# EAGLE schematic Small_robot_PCB_schematic (EAGLE 7.7.0)
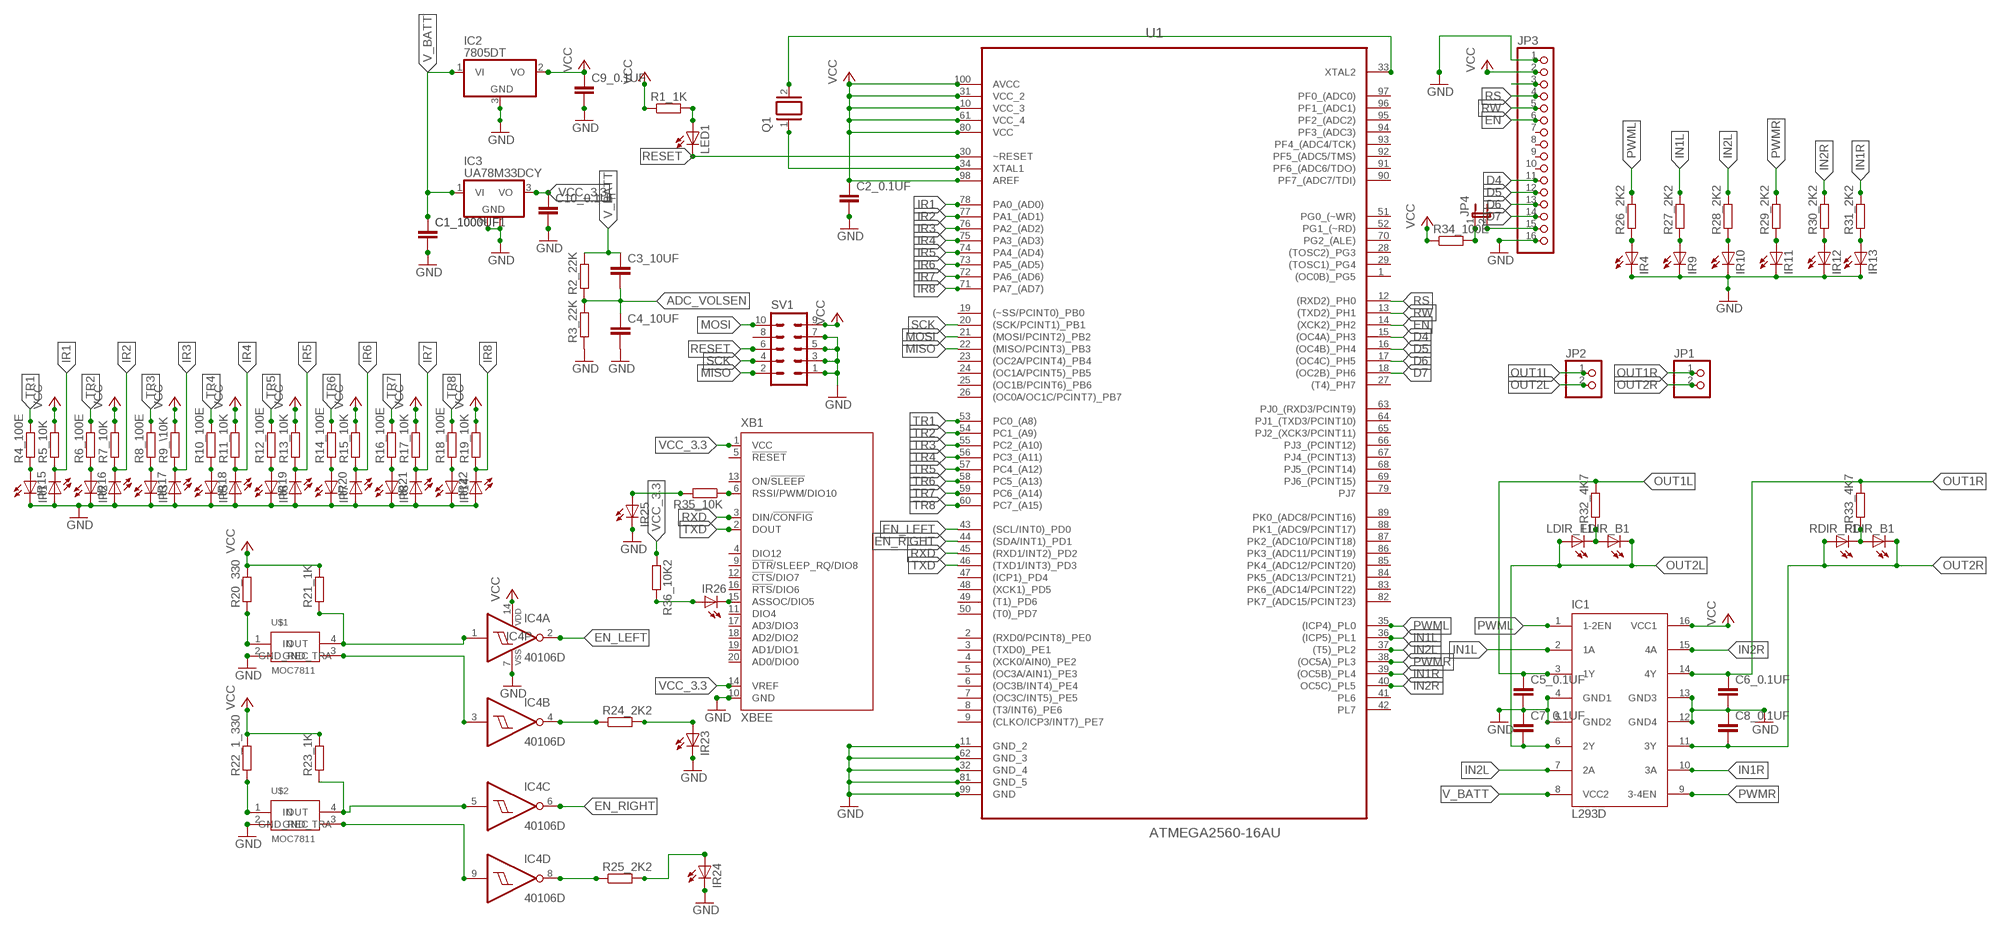
[diagram p0: schematic, sheet 1]

## Parts
C1_1000UF  C-EUC1206  [C1206]
C1_1000UF1  C-EUC1206  [C1206]
C2_0.1UF  C-EUC1206  [C1206]
C3_10UF  C-EUC1206  [C1206]
C4_10UF  C-EUC1206  [C1206]
C5_0.1UF  C-EUC1206  [C1206]
C6_0.1UF  C-EUC1206  [C1206]
C7_0.1UF  C-EUC1206  [C1206]
C8_0.1UF  C-EUC1206  [C1206]
C9_0.1UF  C-EUC1206  [C1206]
C10_0.1UF  C-EUC1206  [C1206]
IC1  L293D  [DIL16]
IC2  7805DT  [TO252]
IC3  UA78M33DCY  [SOT223]
IC4  40106D  [SO14]
IR1  LED5MM  [LED5MM]
IR2  LED5MM  [LED5MM]
IR3  LED5MM  [LED5MM]
IR4  LEDCHIPLED_1206  [CHIPLED_1206]
IR5  LED5MM  [LED5MM]
IR6  LED5MM  [LED5MM]
IR7  LED5MM  [LED5MM]
IR8  LED5MM  [LED5MM]
IR9  LEDCHIPLED_1206  [CHIPLED_1206]
IR10  LEDCHIPLED_1206  [CHIPLED_1206]
IR11  LEDCHIPLED_1206  [CHIPLED_1206]
IR12  LEDCHIPLED_1206  [CHIPLED_1206]
IR13  LEDCHIPLED_1206  [CHIPLED_1206]
IR14  LED5MM  [LED5MM]
IR15  LED5MM  [LED5MM]
IR16  LED5MM  [LED5MM]
IR17  LED5MM  [LED5MM]
IR18  LED5MM  [LED5MM]
IR19  LED5MM  [LED5MM]
IR20  LED5MM  [LED5MM]
IR21  LED5MM  [LED5MM]
IR22  LED5MM  [LED5MM]
IR23  LEDCHIPLED_1206  [CHIPLED_1206]
IR24  LEDCHIPLED_1206  [CHIPLED_1206]
IR25  LEDCHIPLED_1206  [CHIPLED_1206]
IR26  LEDCHIPLED_1206  [CHIPLED_1206]
JP1  PINHD-1X2  [1X02]
JP2  PINHD-1X2  [1X02]
JP3  PINHD-1X16  [1X16]
JP4  JP1E  [JP1]
LDIR_B1  LEDCHIPLED_1206  [CHIPLED_1206]
LDIR_F1  LEDCHIPLED_1206  [CHIPLED_1206]
LED1  LEDCHIPLED_1206  [CHIPLED_1206]
Q1  XTAL  [Q]
R1_1K  R-EU_R1206  [R1206]
R2_22K  R-EU_R1206  [R1206]
R3_22K  R-EU_M1206  [M1206]
R4_100E  R-EU_R1206  [R1206]
R5_10K  R-EU_R1206  [R1206]
R6_100E  R-EU_R1206  [R1206]
R7_10K  R-EU_R1206  [R1206]
R8_100E  R-EU_R1206  [R1206]
R9_\10K  R-EU_R1206  [R1206]
R10_100E  R-EU_R1206  [R1206]
R11_10K  R-EU_R1206  [R1206]
R12_100E  R-EU_R1206  [R1206]
R13_10K  R-EU_R1206  [R1206]
R14_100E  R-EU_R1206  [R1206]
R15_10K  R-EU_R1206  [R1206]
R16_100E  R-EU_R1206  [R1206]
R17_10K  R-EU_R1206  [R1206]
R18_100E  R-EU_R1206  [R1206]
R19_10K  R-EU_R1206  [R1206]
R20_330  R-EU_R1206  [R1206]
R21_1K  R-EU_R1206  [R1206]
R22_1_330  R-EU_R1206  [R1206]
R23_1K  R-EU_R1206  [R1206]
R24_2K2  R-EU_R1206  [R1206]
R25_2K2  R-EU_R1206  [R1206]
R26_2K2  R-EU_R1206  [R1206]
R27_2K2  R-EU_R1206  [R1206]
R28_2K2  R-EU_R1206  [R1206]
R29_2K2  R-EU_R1206  [R1206]
R30_2K2  R-EU_R1206  [R1206]
R31_2K2  R-EU_R1206  [R1206]
R32_4K7  R-EU_R1206  [R1206]
R33_4K7  R-EU_R1206  [R1206]
R34_100E  R-EU_R1206  [R1206]
R35_10K  R-EU_R1206  [R1206]
R36_10K2  R-EU_R1206  [R1206]
RDIR_B1  LEDCHIPLED_1206  [CHIPLED_1206]
RDIR_F1  LEDCHIPLED_1206  [CHIPLED_1206]
SV1  MA05-2  [MA05-2]
U1  ATMEGA2560-16AU  [QFP50P1600X1600X120-100N]
U$1  MOC7811  [THROUGH_HOLE_NORMAL]
U$2  MOC7811  [THROUGH_HOLE_NORMAL]
XB1  XBEE  [XBEE]

## Nets
ADC_VOLSEN: C3_10UF.2 C4_10UF.1 R2_22K.1 R3_22K.2
D4: JP3.11 U1.15((OC4A)_PH3)
D5: JP3.12 U1.16((OC4B)_PH4)
D6: JP3.13 U1.17((OC4C)_PH5)
D7: JP3.14 U1.18((OC2B)_PH6)
EN: JP3.6 U1.14((XCK2)_PH2)
EN_LEFT: IC4.2(A:O) U1.43((SCL/INT0)_PD0)
EN_RIGHT: IC4.6(C:O) U1.44((SDA/INT1)_PD1)
GND: C1_1000UF1.2 C1_1000UF.2 C2_0.1UF.2 C4_10UF.2 C5_0.1UF.2 C6_0.1UF.2 C7_0.1UF.1 C8_0.1UF.1 C9_0.1UF.2 C10_0.1UF.2 IC1.4(GND1) IC1.5(GND2) IC1.12(GND4) IC1.13(GND3) IC2.3(GND) IC3.2(GND) IC3.4(GND) IC4.7(P:VSS) IR1.K(C) IR2.K(C) IR3.K(C) IR4.C IR5.K(C) IR6.K(C) IR7.K(C) IR8.K(C) IR9.C IR10.C IR11.C IR12.C IR13.C IR14.K(C) IR15.A IR16.A IR17.A IR18.A IR19.A IR20.A IR21.A IR22.A IR23.C IR24.C IR25.C JP3.1 JP3.16 R3_22K.1 SV1.1 SV1.3 SV1.5 SV1.7 U1.11(GND_2) U1.32(GND_4) U1.62(GND_3) U1.81(GND_5) U1.99(GND) U$1.2(GND_TRA) U$2.2(GND_TRA) XB1.10(GND)
IN1L: IC1.2(1A) R27_2K2.2 U1.36((ICP5)_PL1)
IN1R: IC1.10(3A) R31_2K2.2 U1.39((OC5B)_PL4)
IN2L: IC1.7(2A) R28_2K2.2 U1.37((T5)_PL2)
IN2R: IC1.15(4A) R30_2K2.2 U1.40(OC5C)_PL5)
IR1: IR15.K(C) R5_10K.1 U1.78(PA0_(AD0))
IR2: IR16.K(C) R7_10K.1 U1.77(PA1_(AD1))
IR3: IR17.K(C) R9_\10K.1 U1.76(PA2_(AD2))
IR4: IR18.K(C) R11_10K.1 U1.75(PA3_(AD3))
IR5: IR19.K(C) R13_10K.1 U1.74(PA4_(AD4))
IR6: IR20.K(C) R15_10K.1 U1.73(PA5_(AD5))
IR7: IR21.K(C) R17_10K.1 U1.72(PA6_(AD6))
IR8: IR22.K(C) R19_10K.1 U1.71(PA7_(AD7))
MISO: SV1.2 U1.22((MISO/PCINT3)_PB3)
MOSI: SV1.10 U1.21((MOSI/PCINT2)_PB2)
N: JP3.3
N$1: R20_330.1 U$1.1(IN)
N$2: Q1.1 U1.34(XTAL1)
N$3: Q1.2 U1.33(XTAL2)
N$4: IR1.A R4_100E.1
N$5: IR2.A R6_100E.1
N$6: IR3.A R8_100E.1
N$7: IR5.A R10_100E.1
N$8: LED1.A R1_1K.2
N$9: IR6.A R12_100E.1
N$10: IR7.A R14_100E.1
N$11: IR8.A R16_100E.1
N$12: IR14.A R18_100E.1
N$14: IR4.A R26_2K2.1
N$15: IC4.4(B:O) R24_2K2.1
N$16: IR23.A R24_2K2.2
N$17: IC4.8(D:O) R25_2K2.1
N$18: IR24.A R25_2K2.2
N$19: R22_1_330.1 U$2.1(IN)
N$21: IR9.A R27_2K2.1
N$22: IR10.A R28_2K2.1
N$23: IC4.5(C:I) R23_1K.1 U$2.4(OUT)
N$24: IR11.A R29_2K2.1
N$25: IR12.A R30_2K2.1
N$26: IR13.A R31_2K2.1
N$27: R35_10K.1 XB1.6(RSSI/PWM/DIO10)
N$28: R33_4K7.1 RDIR_B1.A RDIR_F1.C
N$29: IC4.1(A:I) R21_1K.1 U$1.4(OUT)
N$30: IC4.3(B:I) U$1.3(GND_REC)
N$31: IC4.9(D:I) U$2.3(GND_REC)
N$32: IR25.A R35_10K.2
N$33: IR26.C XB1.15(ASSOC/DIO5)
N$34: IR26.A R36_10K2.2
N$35: LDIR_B1.A LDIR_F1.C R32_4K7.1
N$39: JP3.15 JP4.2
N$49: JP4.1 R34_100E.2
OUT1L: C5_0.1UF.1 IC1.3(1Y) JP2.1 R32_4K7.2
OUT1R: C6_0.1UF.1 IC1.14(4Y) JP1.1 R33_4K7.2
OUT2L: C7_0.1UF.2 IC1.6(2Y) JP2.2 LDIR_B1.C LDIR_F1.A
OUT2R: C8_0.1UF.2 IC1.11(3Y) JP1.2 RDIR_B1.C RDIR_F1.A
PWML: IC1.1(1-2EN) R26_2K2.2 U1.35((ICP4)_PL0)
PWMR: IC1.9(3-4EN) R29_2K2.2 U1.38((OC5A)_PL3)
RESET: LED1.C SV1.6 U1.30(~RESET)
RS: JP3.4 U1.12((RXD2)_PH0)
RW: JP3.5 U1.13((TXD2)_PH1)
RXD: U1.45((RXD1/INT2)_PD2) XB1.3(DIN/!CONFIG)
SCK: SV1.4 U1.20((SCK/PCINT1)_PB1)
TR1: R4_100E.2 U1.53(PC0_(A8))
TR2: R6_100E.2 U1.54(PC1_(A9))
TR3: R8_100E.2 U1.55(PC2_(A10))
TR4: R10_100E.2 U1.56(PC3_(A11))
TR5: R12_100E.2 U1.57(PC4_(A12))
TR6: R14_100E.2 U1.58(PC5_(A13))
TR7: R16_100E.2 U1.59(PC6_(A14))
TR8: R18_100E.2 U1.60(PC7_(A15))
TXD: U1.46((TXD1/INT3)_PD3) XB1.2(DOUT)
V_BATT: C1_1000UF1.1 C1_1000UF.1 C3_10UF.1 IC1.8(VCC2) IC2.1(VI) IC3.1(VI) R2_22K.2
VCC: C2_0.1UF.1 C9_0.1UF.1 IC1.16(VCC1) IC2.2(VO) IC4.14(P:VDD) JP3.2 R1_1K.1 R5_10K.2 R7_10K.2 R9_\10K.2 R11_10K.2 R13_10K.2 R15_10K.2 R17_10K.2 R19_10K.2 R20_330.2 R21_1K.2 R22_1_330.2 R23_1K.2 R34_100E.1 SV1.9 U1.10(VCC_3) U1.31(VCC_2) U1.61(VCC_4) U1.80(VCC) U1.98(AREF) U1.100(AVCC)
VCC_3.3: C10_0.1UF.1 IC3.3(VO) R36_10K2.1 XB1.1(VCC) XB1.14(VREF)
Unconnected: IC4.10(E:O) IC4.11(E:I) IC4.12(F:O) IC4.13(F:I) JP3.7 JP3.8 JP3.9 JP3.10 SV1.8 U1.1((OC0B)_PG5) U1.2((RXD0/PCINT8)_PE0) U1.3((TXD0)_PE1) U1.4((XCK0/AIN0)_PE2) U1.5((OC3A/AIN1)_PE3) U1.6((OC3B/INT4)_PE4) U1.7((OC3C/INT5)_PE5) U1.8((T3/INT6)_PE6) U1.9((CLKO/ICP3/INT7)_PE7) U1.19((~SS/PCINT0)_PB0) U1.23((OC2A/PCINT4)_PB4) U1.24((OC1A/PCINT5)_PB5) U1.25((OC1B/PCINT6)_PB6) U1.26((OC0A/OC1C/PCINT7)_PB7) U1.27((T4)_PH7) U1.28((TOSC2)_PG3) U1.29((TOSC1)_PG4) U1.41(PL6) U1.42(PL7) U1.47((ICP1)_PD4) U1.48((XCK1)_PD5) U1.49((T1)_PD6) U1.50((T0)_PD7) U1.51(PG0_(~WR)) U1.52(PG1_(~RD)) U1.63(PJ0_(RXD3/PCINT9)) U1.64(PJ1_(TXD3/PCINT10)) U1.65(PJ2_(XCK3/PCINT11)) U1.66(PJ3_(PCINT12)) U1.67(PJ4_(PCINT13)) U1.68(PJ5_(PCINT14)) U1.69(PJ6_(PCINT15)) U1.70(PG2_(ALE)) U1.79(PJ7) U1.82(PK7_(ADC15/PCINT23)) U1.83(PK6_(ADC14/PCINT22)) U1.84(PK5_(ADC13/PCINT21)) U1.85(PK4_(ADC12/PCINT20)) U1.86(PK3_(ADC11/PCINT19)) U1.87(PK2_(ADC10/PCINT18)) U1.88(PK1_(ADC9/PCINT17)) U1.89(PK0_(ADC8/PCINT16)) U1.90(PF7_(ADC7/TDI)) U1.91(PF6_(ADC6/TDO)) U1.92(PF5_(ADC5/TMS)) U1.93(PF4_(ADC4/TCK)) U1.94(PF3_(ADC3)) U1.95(PF2_(ADC2)) U1.96(PF1_(ADC1)) U1.97(PF0_(ADC0)) XB1.4(DIO12) XB1.5(!RESET) XB1.9(!DTR!/SLEEP_RQ/DIO8) XB1.11(DIO4) XB1.12(!CTS!/DIO7) XB1.13(ON/!SLEEP) XB1.16(!RTS!/DIO6) XB1.17(AD3/DIO3) XB1.18(AD2/DIO2) XB1.19(AD1/DIO1) XB1.20(AD0/DIO0)

## Library data of the parts
C1_1000UF C1_1000UF1 C2_0.1UF C9_0.1UF C10_0.1UF = resistor:C-EU: CAPACITOR, European symbol
C3_10UF C4_10UF C5_0.1UF C6_0.1UF C7_0.1UF C8_0.1UF = rcl:C-EU: CAPACITOR, European symbol
IC1 = st-microelectronics:L293D: PUSH-PULL 4 CHANNEL DRIVER; MPN: L293D; OC_FARNELL: 9589619; OC_NEWARK: 56P8249
IC2 = linear:78*: Positive VOLTAGE REGULATOR Source: http://cache.national.com/ds/LM/LM78L05.pdf http://www.fairchildsemi.com/ds/LM/LM7805.pdf
IC3 = linear:UA78M*: POSITIVE-VOLTAGE REGULATORS Source: http://focus.ti.com/lit/ds/symlink/ua78m33.pdf
IC4 = 40xx:40106: Hex SCHMITT TRIGGER
IR1-IR26 LDIR_B1 LDIR_F1 LED1 RDIR_B1 RDIR_F1 = led:LED: LED OSRAM: - CHIPLED LG R971, LG N971, LY N971, LG Q971, LY Q971, LO R971, LY R971 LH N974, LH R974 LS Q976, LO Q976, LY Q976 LO Q996 - Hyper CHIPLED LW Q18S LB Q993, LB Q99A, LB R99A - SideLED LS A670, LO A670, LY A670, LG A670, LP A670 LB A673, LV A673, LT A673, LW A673 LH A674 LY A675 LS A676, LA A676, LO A676, LY A676, LW A676 LS A679, LY A679, LG A679 - Hyper Micro SIDELED® LS Y876, LA Y876, LO Y876, LY Y876 LT Y87S - SmartLED LW L88C, LW L88S LB L89C, LB L89S, LG L890 LS L89K, LO L89K, LY L89K LS L896, LA L896, LO L896, LY L896 - TOPLED LS T670, LO T670, LY T670, LG T670, LP T670 LSG T670, LSP T670, LSY T670, LOP T670, LYG T670 LG T671, LOG T671, LSG T671 LB T673, LV T673, LT T673, LW T673 LH T674 LS T676, LA T676, LO T676, LY T676, LB T676, LH T676, LSB T676, LW T676 LB T67C, LV T67C, LT T67C, LS T67K, LO T67K, LY T67K, LW E67C LS E67B, LA E67B, LO E67B, LY E67B, LB E67C, LV E67C, LT E67C LW T67C LS T679, LY T679, LG T679 LS T770, LO T770, LY T770, LG T770, LP T770 LB T773, LV T773, LT T773, LW T773 LH T774 LS E675, LA E675, LY E675, LS T675 LS T776, LA T776, LO T776, LY T776, LB T776 LHGB T686 LT T68C, LB T68C - Hyper Mini TOPLED® LB M676 - Mini TOPLED Santana® LG M470 LS M47K, LO M47K, LY M47K Source: http://www.osram.convergy.de LUXEON: - LUMILED® LXK2-PW12-R00, LXK2-PW12-S00, LXK2-PW14-U00, LXK2-PW14-V00 LXK2-PM12-R00, LXK2-PM12-S00, LXK2-PM14-U00 LXK2-PE12-Q00, LXK2-PE12-R00, LXK2-PE12-S00, LXK2-PE14-T00, LXK2-PE14-U00 LXK2-PB12-K00, LXK2-PB12-L00, LXK2-PB12-M00, LXK2-PB14-N00, LXK2-PB14-P00, LXK2-PB14-Q00 LXK2-PR12-L00, LXK2-PR12-M00, LXK2-PR14-Q00, LXK2-PR14-R00 LXK2-PD12-Q00, LXK2-PD12-R00, LXK2-PD12-S00 LXK2-PH12-R00, LXK2-PH12-S00 LXK2-PL12-P00, LXK2-PL12-Q00, LXK2-PL12-R00 Source: www.luxeon.com KINGBRIGHT: KA-3528ASYC Source: www.kingbright.com
JP1 JP2 = pinhead:PINHD-1X2: PIN HEADER
JP3 = pinhead:PINHD-1X16: PIN HEADER
JP4 = jumper:JP1E: JUMPER
Q1 = special:XTAL: CRYSTAL
R1_1K R2_22K R3_22K R4_100E R5_10K R6_100E R7_10K R8_100E R9_\10K R10_100E R11_10K R12_100E R13_10K R14_100E R15_10K R16_100E R17_10K R18_100E R19_10K R20_330 R21_1K R22_1_330 R23_1K R24_2K2 R25_2K2 R26_2K2 R27_2K2 R28_2K2 R29_2K2 R30_2K2 R31_2K2 R32_4K7 R33_4K7 R34_100E R35_10K R36_10K2 = resistor:R-EU_: RESISTOR, European symbol
SV1 = con-lstb:MA05-2: PIN HEADER; OC_FARNELL: unknown; OC_NEWARK: unknown
U1 = Atmel_By_element14_Batch_1-00:ATMEGA2560-16AU: Microcontroller; DESCRIPTION: Microcontroller; MPN: ATMEGA2560-16AU; OC_FARNELL: 1288330; OC_NEWARK: 23M5051; PACKAGE: LQFP-100; SUPPLIER: ATMEL
U$1 U$2 = Motor encoder MOC7811:MOC7811: MOC7811 is a slotted opto isolator module, with an IR transmitter and a photodiode mounted on it. Performs Non-Contact Object Sensing
XB1 = xbee:XBEE: XBee (TM) /XBee-PRO(TM) OEM RF Modules Source: MaxStream, Inc. xbee_productmanual.pdf; MPN: XBP24-Z7UIT-004; OC_FARNELL: 1751799; OC_NEWARK: 34R5507